# EAGLE design QREx4 (EAGLE 9.4.2)
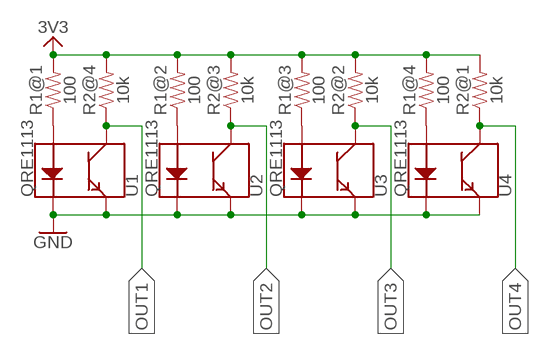
[diagram p0: schematic, sheet 1]

## Parts
R1  100  RESISTOR_ARRAY_1206_SEPARATE  [RESCAF80P320X160X60-8N]
R2  10k  RESISTOR_ARRAY_1206_SEPARATE  [RESCAF80P320X160X60-8N]
U1  QRE1113  QRE1113SMD-W  [QRE1113-W]
U2  QRE1113  QRE1113SMD-W  [QRE1113-W]
U3  QRE1113  QRE1113SMD-W  [QRE1113-W]
U4  QRE1113  QRE1113SMD-W  [QRE1113-W]

## Nets
3.3V: R1.5 R1.6 R1.7 R1.8 R2.5 R2.6 R2.7 R2.8 ; supply symbol labelled SUPPLY_3.3V
GND: U1.2(K) U1.4(E) U2.2(K) U2.4(E) U3.2(K) U3.4(E) U4.2(K) U4.4(E) ; supply symbol labelled SUPPLY_GND
N$1: R1.1 U1.1(A)
N$2: R1.2 U2.1(A)
N$3: R1.3 U3.1(A)
N$4: R1.4 U4.1(A)
OUT1: R2.4 U1.3(C)
OUT2: R2.3 U2.3(C)
OUT3: R2.2 U3.3(C)
OUT4: R2.1 U4.3(C)

## Library data of the parts
R1 R2 = Scott-Electrical:RESISTOR_ARRAY_1206_SEPARATE
U1-U4 = Scott-Sensors:QRE1113: QRE1113 Reflective Object Sensor The QRE1113 is a small IR reflectance sensor. This sensor is often used in line following robots because, if it can sense if a surface is white or black. There are four pins on the QRE1113 - two control the IR emitting LED while the other two are the collector and emitter of a phototransistor. The IR diode has a max forward current of 50mA and operates at 940nm. Datasheet <http://www.sparkfun.com/datasheets/Components/SMD/QRE1113.GR.pdf> SparkFun Products IR Reflectance Sensor - QRE1113 <https://www.sparkfun.com/products/9542> (COM-09542) SparkFun Line Sensor Breakout - QRE1113 (Analog) <https://www.sparkfun.com/products/9453> (ROB-09453) SparkFun Line Sensor Breakout - QRE1113 (Digital) <https://www.sparkfun.com/products/9454> (ROB-09454) SparkFun RedBot Sensor - Line Follower <https://www.sparkfun.com/products/11769> (SEN-11769) SparkFun RedBot Sensor - Wheel Encoder <https://www.sparkfun.com/products/12617> (SEN-12617) SparkFun Line Follower Array <https://www.sparkfun.com/products/13582> (SEN-13582); PROD_ID: IC-09357; SF_ID: COM-09542

## Board
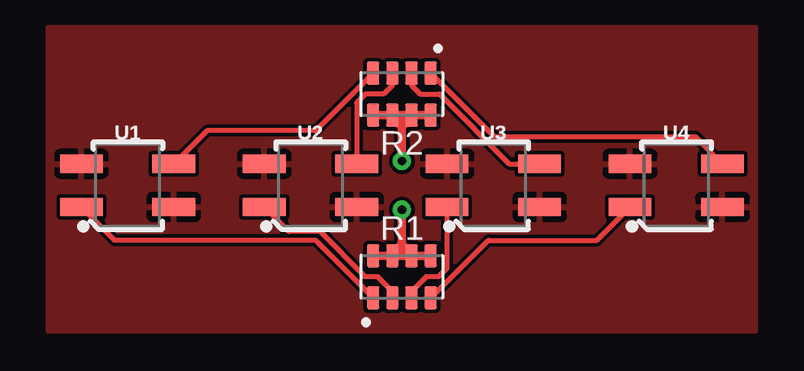
[diagram p1: board, top side]
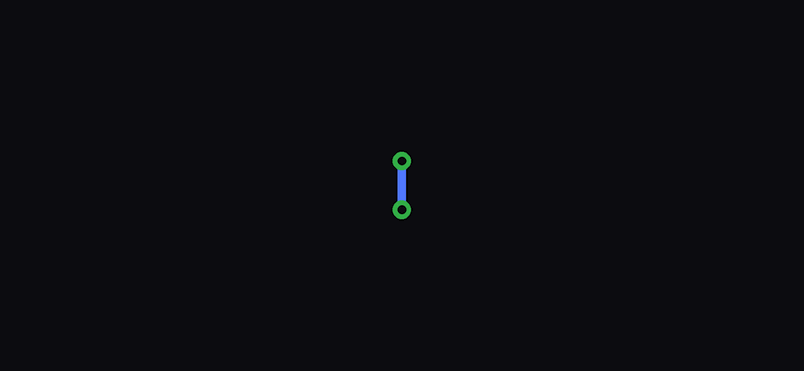
[diagram p2: board, bottom side, seen from below]

No outline drawn. Coordinates in mm, seen from the top.
Copper layers (1*16): Top 0.035mm / dielectric 0.15mm / Bottom 0.035mm
Design rules "default": minimum track width 6mil, minimum drill 0.35mm, track to track 6mil, track to pad 6mil, pad to pad 6mil, via to via 6mil, smd to smd 6mil, copper to edge 40mil, drill to drill 6mil, minimum pad ring 10mil, minimum via ring 8mil, stop-mask expansion 4mil, vias tented up to drill 0mil, thermal gap 10mil

### Footprints (pad centres in the part's own frame; a part is rotated, then mirrored left to right if it is on the bottom)
RESCAF80P320X160X60-8N = smd 0.97 x 0.53: 1 -0.875,1.2; 2 -0.875,0.4; 3 -0.875,-0.4; 4 -0.875,-1.2; 5 0.875,-1.2; 6 0.875,-0.4; 7 0.875,0.4; 8 0.875,1.2
QRE1113-W = smd 1.778 x 0.762: 1 -1.927,-0.9; 2 1.927,-0.9; 3 1.927,0.9; 4 -1.927,0.9

### Placement (x,y rotation side)
R1  11.43,-3.81 90 top
R2  11.43,3.81 270 top
U1  0,0 0 top
U2  7.62,0 0 top
U3  15.24,0 0 top
U4  22.86,0 0 top

### Tracks (layer width: path | path; a pad name or v marks a point on that pad's centre or on a via)
3.3V  (via drill 0.35)
  Top 0.152: R2.6 11.03,2.69 11.43,2.29 11.83,2.69 R2.7 | R1.7 11.03,-2.69 11.43,-2.29 11.83,-2.69 R1.6
  Top 0.356: R2.5 R2.6 11.43,2.94 | 11.43,2.94 R2.7 R2.8 | R1.5 R1.6 11.43,-2.94 | 11.43,-2.94 R1.7 R1.8 | 11.43,-2.94 11.43,-2.29 v11.43,-1.02 | 11.43,2.94 11.43,2.29 v11.43,1.02
  Bottom 0.356: v11.43,1.02 v11.43,-1.02
GND
  pour Top: -3.3,6.6 26.16,6.6 26.16,-6.1 -3.3,-6.1
N$1
  Top 0.203: R1.1 7.83,-2.29 -0.54,-2.29 U1.1
N$2
  Top 0.203: R1.2 11.03,-4.42 10.43,-3.81 9.9,-3.81 8.02,-1.93 6.72,-1.93 U2.1
N$3
  Top 0.203: U3.1 13.31,-3.45 12.95,-3.81 12.44,-3.81 11.83,-4.42 R1.3
N$4
  Top 0.203: R1.4 15.03,-2.29 19.56,-2.29 20.93,-0.91 U4.1
OUT1
  Top 0.203: R2.4 7.83,2.29 3.31,2.29 U1.3
OUT2
  Top 0.203: R2.3 11.03,4.17 10.67,3.81 9.91,3.81 9.55,3.45 U2.3
OUT3
  Top 0.203: R2.2 11.83,4.17 12.19,3.81 13,3.81 15.91,0.9 U3.3
OUT4
  Top 0.203: R2.1 15.28,2.03 23.66,2.03 U4.3